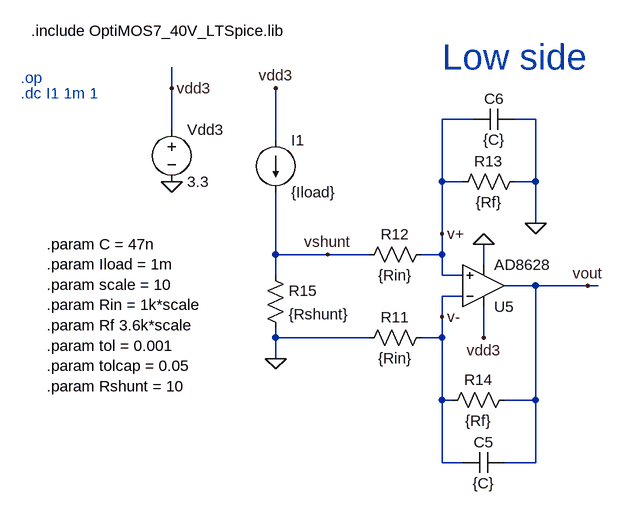
[diagram p0: schematic Preamp_uA_DC.asc]
Preamp_uA_DC.asc, the LTspice schematic file:
Version 4.1
SHEET 1 1844 1640
WIRE 496 512 496 480
WIRE 960 560 912 560
WIRE 1056 560 1024 560
WIRE 496 576 496 512
WIRE 656 592 656 512
WIRE 912 656 912 560
WIRE 944 656 912 656
WIRE 1056 656 1056 560
WIRE 1056 656 1024 656
WIRE 1056 720 1056 656
WIRE 912 736 912 656
WIRE 656 768 656 672
WIRE 736 768 656 768
WIRE 800 768 736 768
WIRE 912 768 912 736
WIRE 912 768 880 768
WIRE 976 784 976 752
WIRE 656 800 656 768
WIRE 912 800 912 768
WIRE 944 800 912 800
WIRE 1056 816 1008 816
WIRE 1136 816 1056 816
WIRE 1152 816 1136 816
WIRE 944 832 912 832
WIRE 912 864 912 832
WIRE 656 896 656 880
WIRE 800 896 656 896
WIRE 912 896 912 864
WIRE 912 896 880 896
WIRE 976 896 976 848
WIRE 656 928 656 896
WIRE 912 992 912 896
WIRE 928 992 912 992
WIRE 1056 992 1056 816
WIRE 1056 992 1008 992
WIRE 912 1088 912 992
WIRE 944 1088 912 1088
WIRE 1056 1088 1056 992
WIRE 1056 1088 1008 1088
FLAG 976 896 vdd3
FLAG 656 512 vdd3
FLAG 656 928 0
FLAG 976 752 0
FLAG 1056 720 0
FLAG 1136 816 vout
FLAG 496 656 0
FLAG 496 512 vdd3
FLAG 736 768 vshunt
FLAG 912 736 v+
FLAG 912 864 v-
SYMBOL res 896 880 R90
WINDOW 0 0 56 VBottom 2
WINDOW 3 32 56 VTop 2
SYMATTR InstName R11
SYMATTR Value {Rin}
SYMBOL res 896 752 R90
WINDOW 0 0 56 VBottom 2
WINDOW 3 32 56 VTop 2
SYMATTR InstName R12
SYMATTR Value {Rin}
SYMBOL res 1040 640 R90
WINDOW 0 0 56 VBottom 2
WINDOW 3 32 56 VTop 2
SYMATTR InstName R13
SYMATTR Value {Rf}
SYMBOL res 1024 976 R90
WINDOW 0 0 56 VBottom 2
WINDOW 3 32 56 VTop 2
SYMATTR InstName R14
SYMATTR Value {Rf}
SYMBOL res 640 784 R0
SYMATTR InstName R15
SYMATTR Value {Rshunt}
SYMBOL cap 1008 1072 R90
WINDOW 0 0 32 VBottom 2
WINDOW 3 32 32 VTop 2
SYMATTR InstName C5
SYMATTR Value {C}
SYMBOL cap 1024 544 R90
WINDOW 0 0 32 VBottom 2
WINDOW 3 32 32 VTop 2
SYMATTR InstName C6
SYMATTR Value {C}
SYMBOL OpAmps\\AD8628 976 880 M180
SYMATTR InstName U5
SYMBOL voltage 496 560 R0
SYMATTR InstName Vdd3
SYMATTR Value 3.3
SYMBOL current 656 592 R0
WINDOW 123 0 0 Left 0
WINDOW 39 0 0 Left 0
SYMATTR InstName I1
SYMATTR Value {Iload}
TEXT 304 752 Left 2 !.param C = 47n\n.param Iload = 1m\n.param scale = 10\n.param Rin = 1k*scale\n.param Rf 3.6k*scale\n.param tol = 0.001\n.param tolcap = 0.05\n.param Rshunt = 10
TEXT 264 520 Left 2 ;.dc I1 1m 1
TEXT 264 496 Left 2 ;.op
TEXT 912 464 Left 5 ;Low side
TEXT 280 424 Left 2 !.include OptiMOS7_40V_LTSpice.lib

The netlist it stands for:
* Preamp_uA_DC.asc
R11 v- 0 {Rin}
R12 v+ vshunt {Rin}
R13 0 v+ {Rf}
R14 vout v- {Rf}
R15 vshunt 0 {Rshunt}
C5 vout v- {C}
C6 0 v+ {C}
X§U5 v+ v- vdd3 0 vout AD8628  ; pins In+ In- V+ V- OUT
Vdd3 vdd3 0 3.3
I1 vdd3 vshunt {Iload}
.param C = 47n
.param Iload = 1m
.param scale = 10
.param Rin = 1k*scale
.param Rf 3.6k*scale
.param tol = 0.001
.param tolcap = 0.05
.param Rshunt = 10
* .dc I1 1m 1
* .op
* Low side
.include OptiMOS7_40V_LTSpice.lib
.backanno
.end